# Altium schematic sheet GateDriver.SchDoc
size A; SheetNumber: 2; SheetTotal: 12
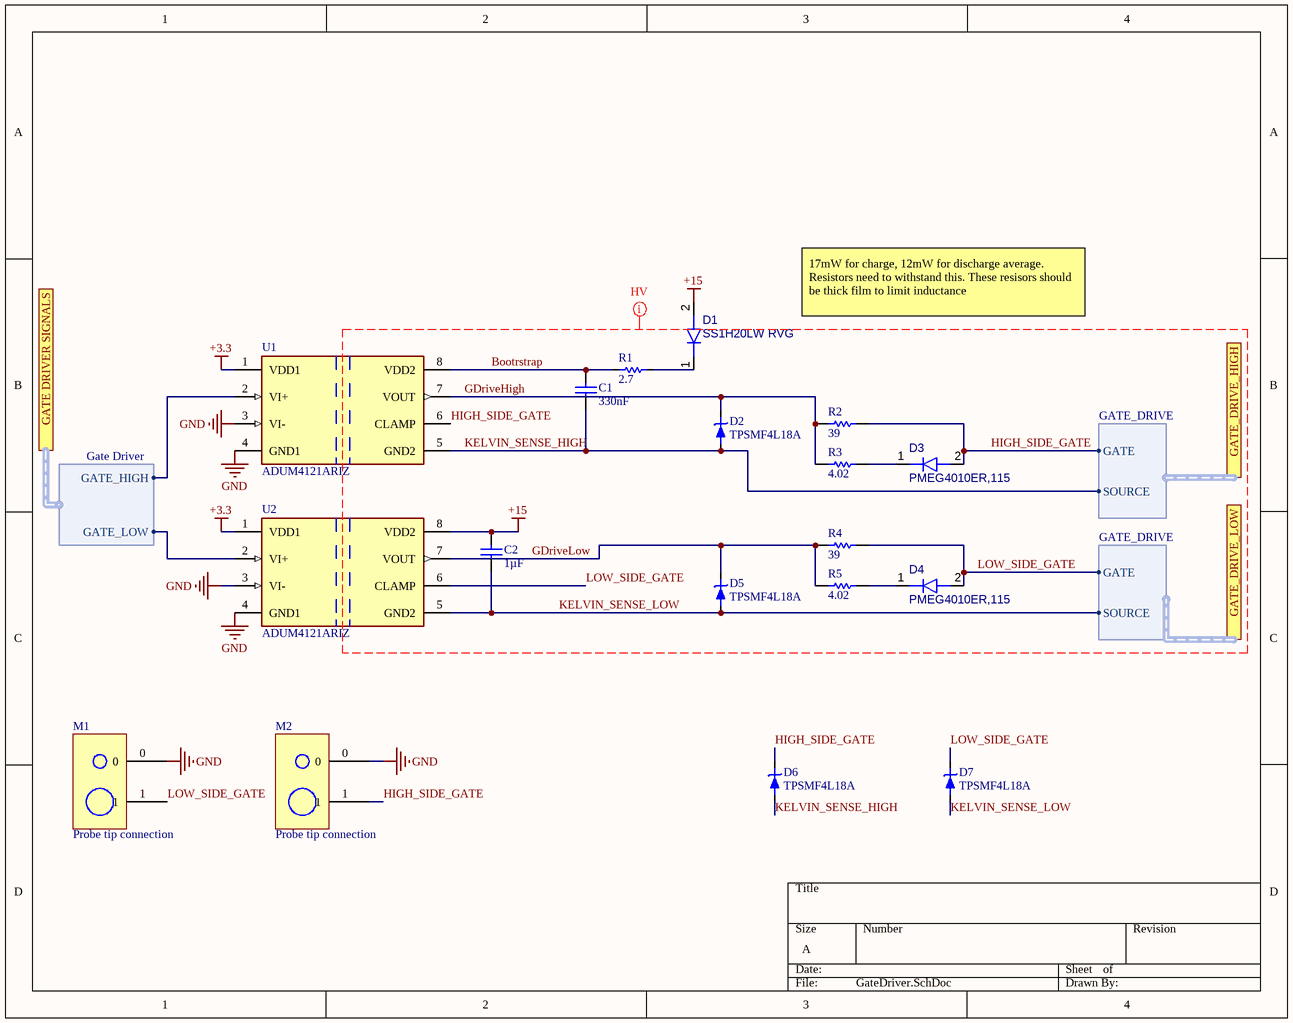
[diagram p0: GateDriver.SchDoc]

## Parts
C1  value 330nF  [1206_CAPACITOR]  (hidden comment: C1206X334K5RACAUTO)
C2  value 1µF  [0805_Capacitor]  (hidden comment: CAP 0805 1uF 50V)
D1  SS1H20LW RVG  [PMEG4010ER,115-Footprint-1]
D2  TPSMF4L18A  [TPSMF4L18A-Footprint-1]
D3  PMEG4010ER,115  [PMEG4010ER,115-Footprint-1]
D4  PMEG4010ER,115  [PMEG4010ER,115-Footprint-1]
D5  TPSMF4L18A  [TPSMF4L18A-Footprint-1]
D6  TPSMF4L18A  [TPSMF4L18A-Footprint-1]
D7  TPSMF4L18A  [TPSMF4L18A-Footprint-1]
M1  Probe tip connection  [Probe tip connection-Footprint-1]
M2  Probe tip connection  [Probe tip connection-Footprint-1]
R1  value 2.7  [1210_Resistor]  (hidden comment: R_CRCW12102R70JNEA)
R2  value 39  [0805_Resistor]  (hidden comment: RMCF0805JT39R0)
R3  value 4.02  [0805_Resistor]  (hidden comment: CRCW08054R02FKEA)
R4  value 39  [0805_Resistor]  (hidden comment: RMCF0805JT39R0)
R5  value 4.02  [0805_Resistor]  (hidden comment: CRCW08054R02FKEA)
U1  ADUM4121ARIZ  [FP-RI-8-1-IPC_B]
U2  ADUM4121ARIZ  [FP-RI-8-1-IPC_B]

## Ports
GATE DRIVER SIGNALS (harness Gate Driver, see MPPT[1C], MicroController[3A]), GATE_DRIVE_HIGH (harness GATE_DRIVE, see MPPT[1C], Power[3C]), GATE_DRIVE_LOW (harness GATE_DRIVE, see MPPT[1B], Power[3C])

## Harnesses
Gate Driver: GATE_HIGH, GATE_LOW
GATE_DRIVE: SOURCE, GATE

## Nets
+3.3: U1.1(VDD1) U2.1(VDD1)
+15: C2.2 D1.2(A) U2.8(VDD2)
GND: M1.0 M2.0 U1.3(VI-) U1.4(GND1) U2.3(VI-) U2.4(GND1)
Bootrstrap: C1.2 R1.1 U1.8(VDD2)
GDriveHigh: D2.2(Cathode) R2.1 R3.1 U1.7(VOUT)
GDriveLow: D5.2(Cathode) R4.1 R5.1 U2.7(VOUT)
HIGH_SIDE_GATE: D3.2(A) D6.2(Cathode) M2.1 R2.2 U1.6(CLAMP) ; port GATE_DRIVE_HIGH.GATE
KELVIN_SENSE_HIGH: C1.1 D2.1(Anode) D6.1(Anode) U1.5(GND2) ; port GATE_DRIVE_HIGH.SOURCE
KELVIN_SENSE_LOW: C2.1 D5.1(Anode) D7.1(Anode) U2.5(GND2) ; port GATE_DRIVE_LOW.SOURCE
LOW_SIDE_GATE: D4.2(A) D7.2(Cathode) M1.1 R4.2 U2.6(CLAMP) ; port GATE_DRIVE_LOW.GATE
NetD1_1: D1.1(K) R1.2
NetD3_1: D3.1(K) R3.2
NetD4_1: D4.1(K) R5.2
NetU1_2: U1.2(VI+) ; port GATE DRIVER SIGNALS.GATE_HIGH
NetU2_2: U2.2(VI+) ; port GATE DRIVER SIGNALS.GATE_LOW

## Layout directives
net class HV: +15, Bootrstrap, GDriveHigh, GDriveLow, HIGH_SIDE_GATE, KELVIN_SENSE_HIGH, KELVIN_SENSE_LOW, LOW_SIDE_GATE

## Notes on the sheet
- 17mW for charge, 12mW for discharge average. Resistors need to withstand this. These resisors should be thick film to limit inductance

## Library data of the parts
C1 = CMP-001-00124-1: Ceramic Capacitor, Multilayer, Ceramic, 50V, 10% +Tol, 10% -Tol, X7R, 15% TC, 0.33uF, Surface Mount, 1206; Pins: 2; Case/Package: 1206; Tolerance: 10%; Max Operating Temperature: 125°C; Capacitor Type: Ceramic; Mounting Technology: SMD; Voltage Rating: 50V; Min Operating Temperature: -55°C
C2 = CMP-001-00098-1: Tolerance: 10%; Capacitor Type: Ceramic; Voltage Rating: 50V; Case/Package: 0805; Mounting Technology: SMT
D1 = CMP-004-00055-1: Rectifier Diode Schottky 200V 1A 2-Pin SOD-123W T/R; Max Surge Current: 40A; Forward Voltage: 490mV; Forward Current: 1A; Max Operating Temperature: 150°C; Average Rectified Current: 1A; Packaging: Tape and Reel; RoHS Compliant: Yes; Pins: 2; Mounting Technology: Surface Mount; Max Reverse Voltage (DC): 200V
D2 D5-D7 = CMP-004-00053-2: TVS DIODE 18V 29.2V SOD123FL; Min Breakdown Voltage: 20V; Peak Pulse Power: 400W; Number of Unidirectional Channels: 1; Peak Pulse Current: 13.7A; Power Line Protection: No; Max Operating Temperature: 150°C; Packaging: Cut Tape; Min Operating Temperature: -55°C; RoHS Compliant: Yes; Reverse Standoff Voltage: 18V; Resistor Type: Zener; Mounting Technology: Surface Mount; Clamping Voltage: 29.2V
D3 D4 = CMP-004-00045-1: Rectifier Diode, Schottky, 1 Phase, 1 Element, 1A, 40V V(RRM), Silicon; Max Surge Current: 40A; Forward Voltage: 490mV; Forward Current: 1A; Peak Inverse Voltage: 40V; Max Operating Temperature: 150°C; Case/Package: SOD-123W; RoHS Compliant: Yes; Pins: 2; Mounting Technology: SMD
M1 M2 = CMP-00028-00009-3: Connection for oscilscope ground tip
R1 = CMP-058-000074-3: RES SMD 2.7 OHM 5% 1/2W 1210; Power: 500mW; Voltage Rating: 200V; Min Operating Temperature: -55°C; Case/Package: 1210; Pins: 2; Max Operating Temperature: 155°C; Tolerance: 5%; Mounting Technology: SMD
R2 R4 = Resistor     0012-1: Fixed Resistor, Metal Glaze/thick Film, 0.125W, 39ohm, 150V, 5% +/-Tol, 200ppm/Cel, Surface Mount, 0805; Power: 125mW; Mounting Technology: SMD; Min Operating Temperature: -55°C; RoHS Compliant: Yes; Tolerance: 5%; Max Operating Temperature: 155°C; Case/Package: 0805
R3 R5 = Resistor     0013-1: Fixed Resistor, Metal Glaze/thick Film, 0.125W, 4.02ohm, 150V, 1% +/-Tol, 100ppm/Cel, Surface Mount, 0805; Power: 125mW; Tolerance: 1%; Mounting Technology: SMD; Min Operating Temperature: -55°C; Case/Package: 0805; RoHS Compliant: Yes; Max Operating Temperature: 155°C
U1 U2 = CMP-00024-00007-1: 2A gat driver; Pins: 8; RoHS Compliant: Yes; Max Operating Temperature: 125°C; Min Operating Temperature: -40°C